# Altium schematic sheet Sheet2.SchDoc
size C; SheetNumber: 1; SheetTotal: 1
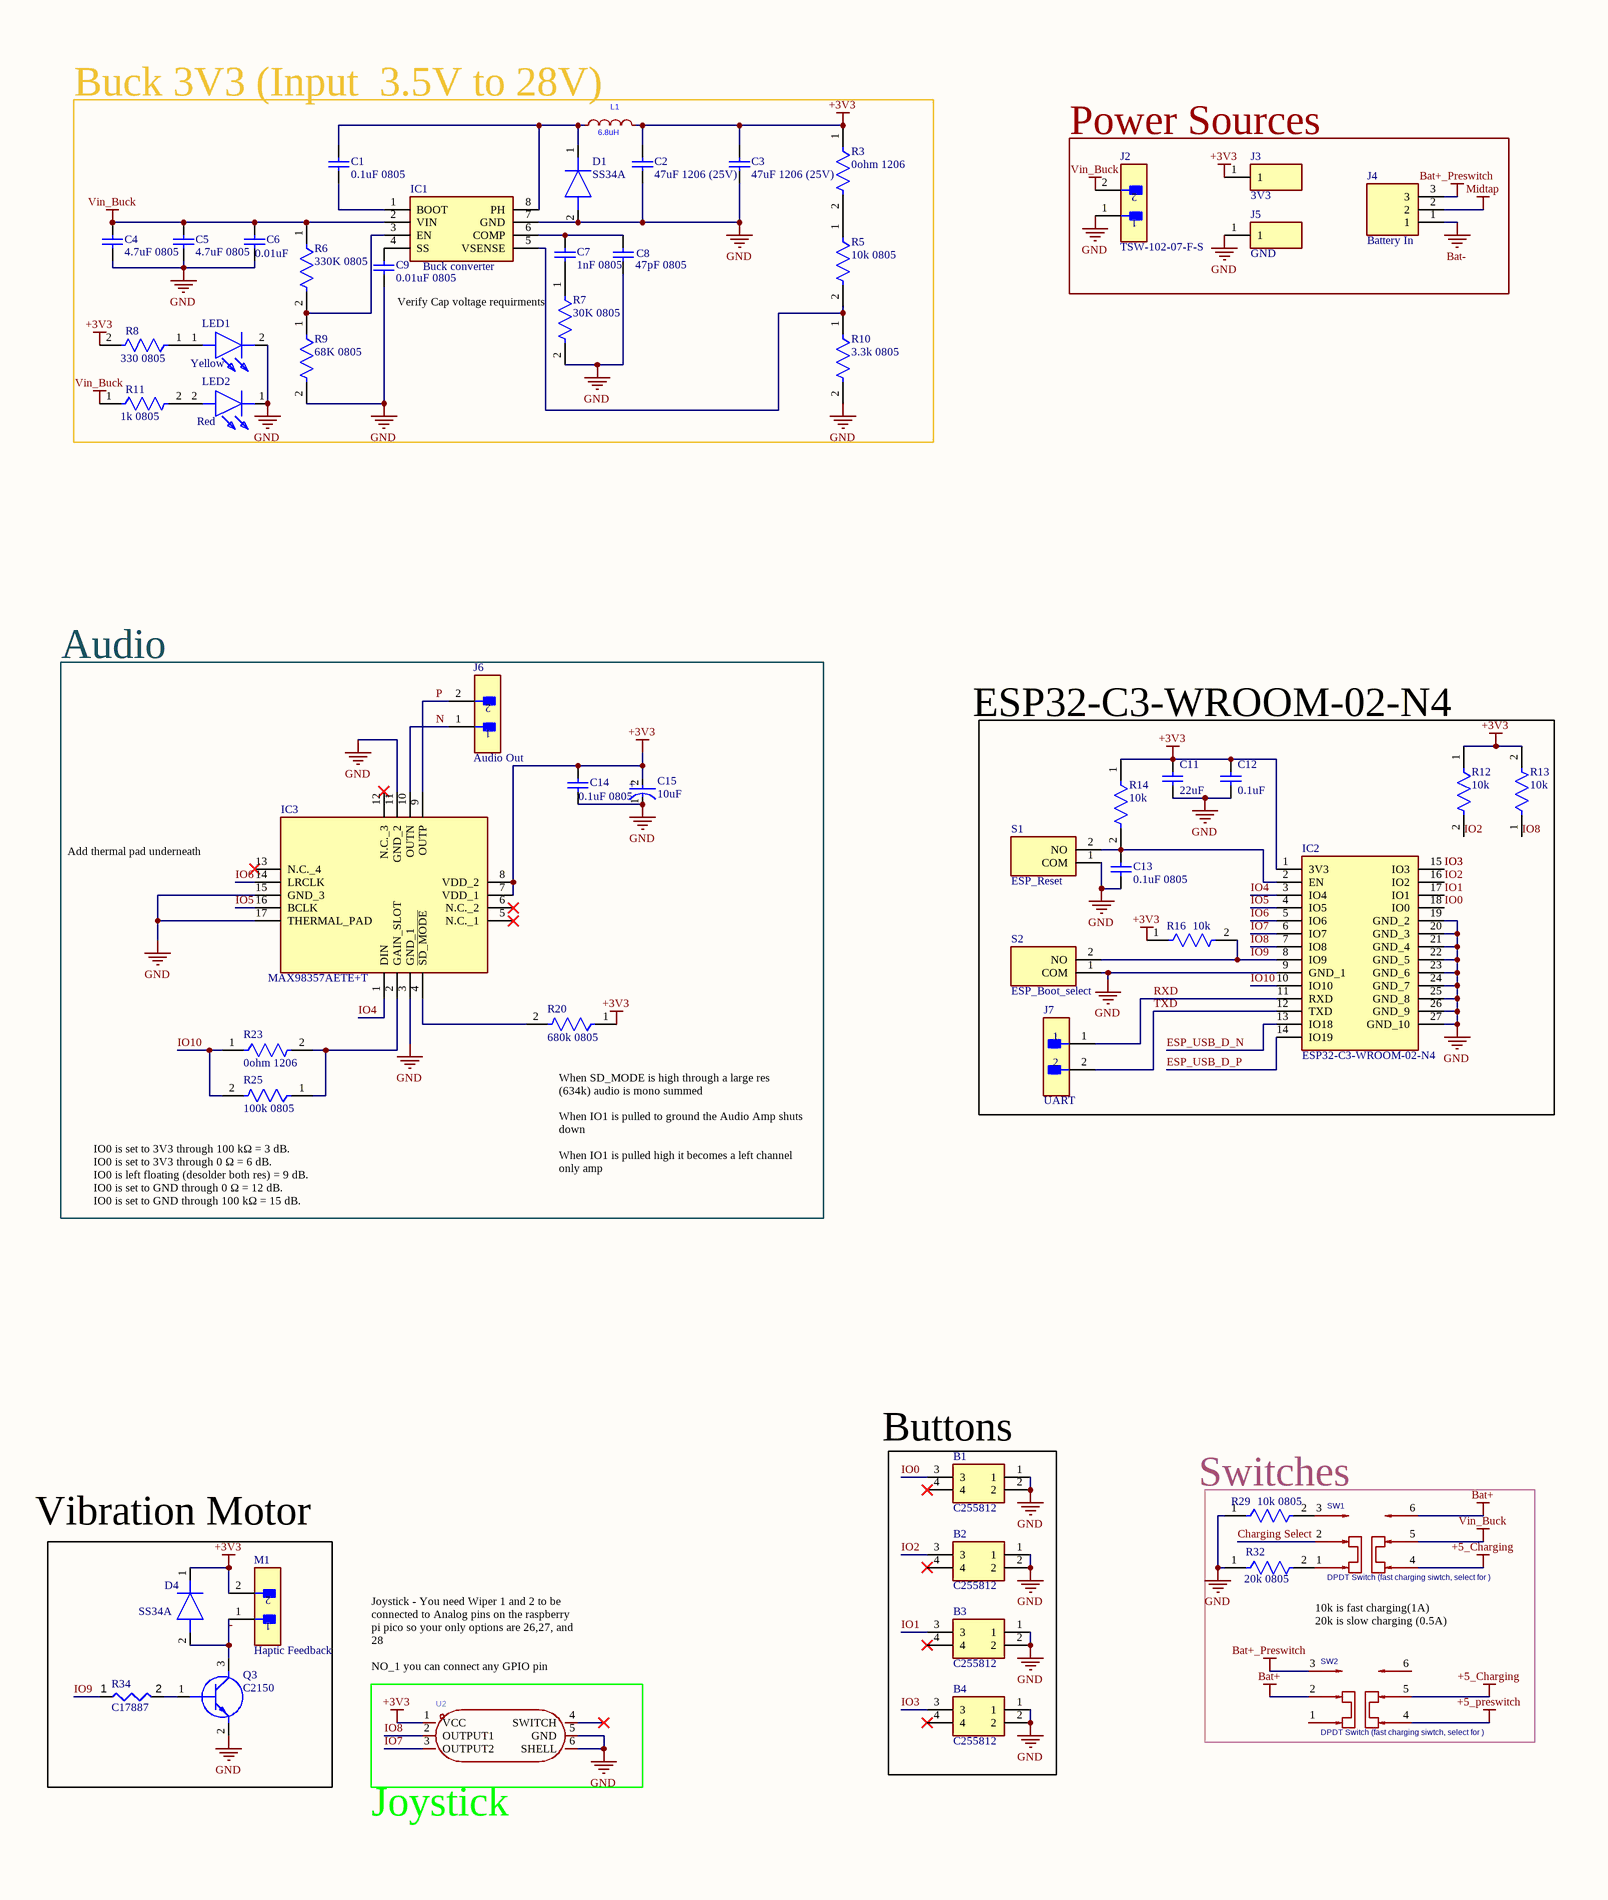
[diagram p0: Sheet2.SchDoc, left]
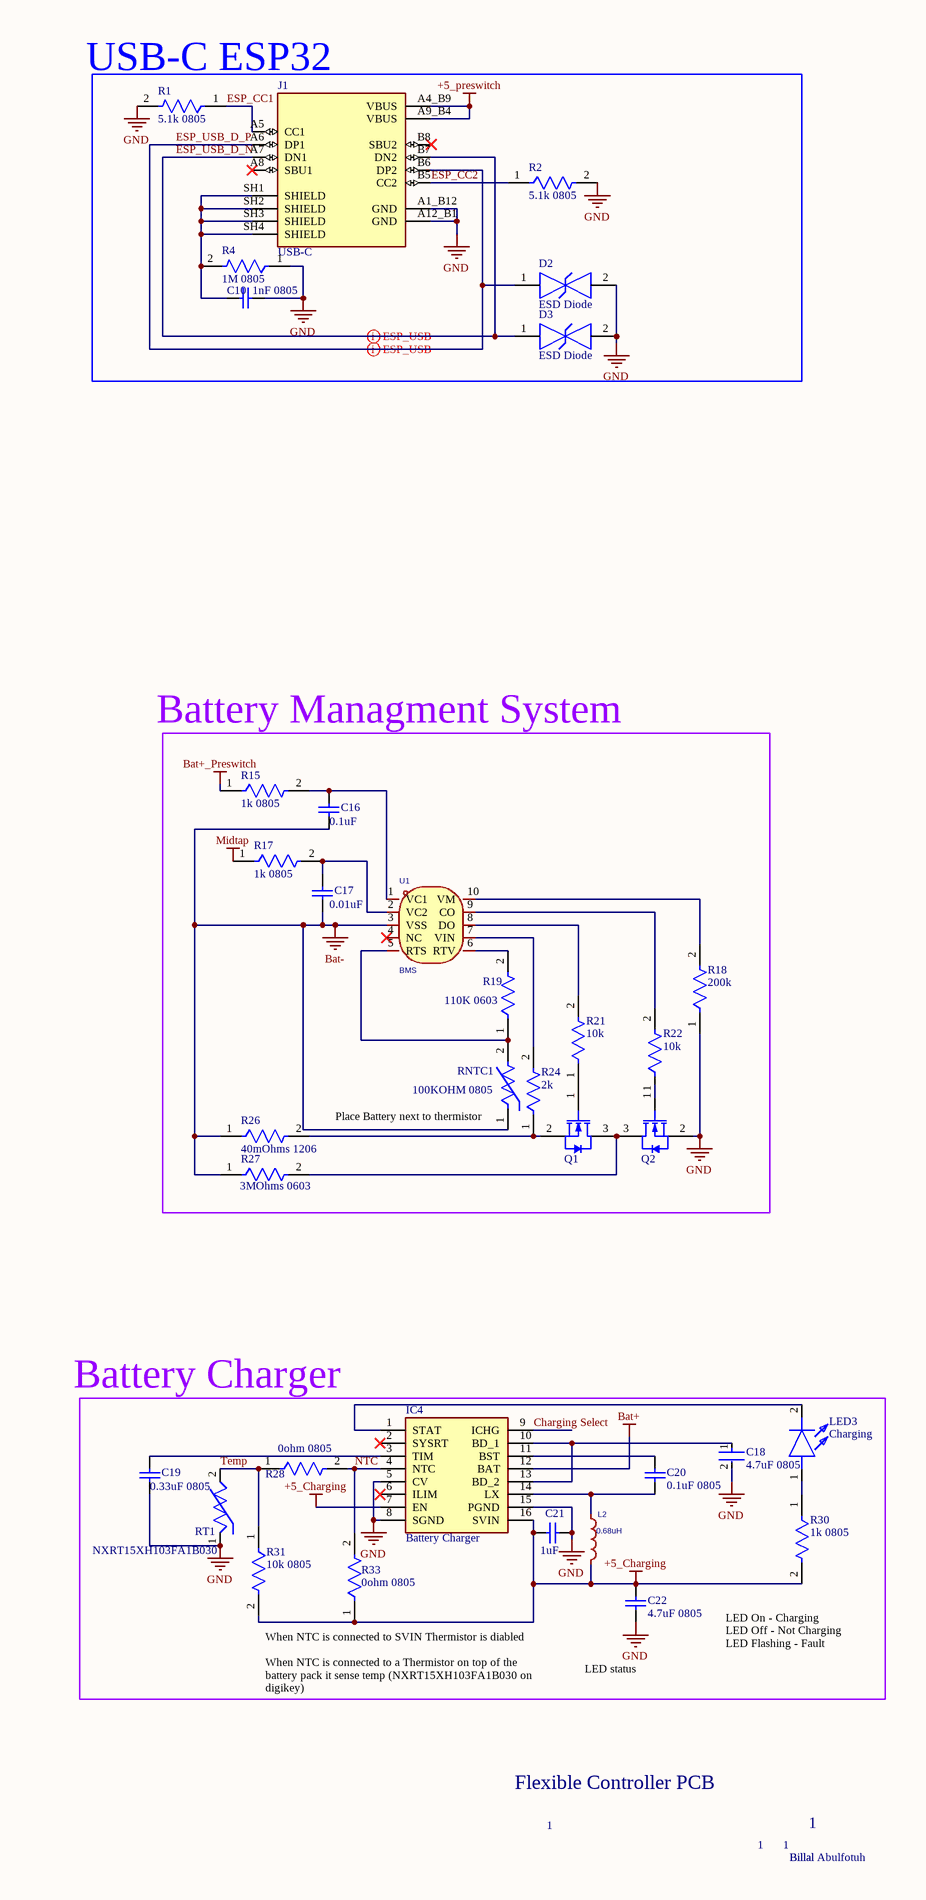
[diagram p1: Sheet2.SchDoc, right]

## Parts
B1  C255812  [Button]
B2  C255812  [Button]
B3  C255812  [Button]
B4  C255812  [Button]
C1  0.1uF 0805  [CAPC2013X94X50LL20T25]
C2  47uF 1206 (25V)  [CAPC1206(3216)190_N]
C3  47uF 1206 (25V)  [CAPC1206(3216)190_N]
C4  4.7uF 0805  [CAPC2013X94X50LL20T25]
C5  4.7uF 0805  [CAPC2013X94X50LL20T25]
C6  0.01uF  [CAPC2013X94X50LL20T25]
C7  1nF 0805  [CAPC2013X94X50LL20T25]
C8  47pF 0805  [CAPC2013X94X50LL20T25]
C9  0.01uF 0805  [CAPC2013X94X50LL20T25]
C10  1nF 0805  [CAPC2013X94X50LL20T25]
C11  22uF  [CAPC2013X94X50LL20T25]
C12  0.1uF  [CAPC2013X94X50LL20T25]
C13  0.1uF 0805  [CAPC2013X94X50LL20T25]
C14  0.1uF 0805  [CAPC2013X94X50LL20T25]
C15  10uF  [FP-TAJA-MFG]
C16  0.1uF  [CAPC2013X94X50LL20T25]
C17  0.01uF  [CAPC2013X94X50LL20T25]
C18  4.7uF 0805  [FP-CC0805-0_85-MFG]
C19  0.33uF 0805  [CAPC2013X94X50LL20T25]
C20  0.1uF 0805  [CAPC2013X94X50LL20T25]
C21  1uF  [CAPC2013X94X50LL20T25]
C22  4.7uF 0805  [CAPC2013X94X50LL20T25]
D1  SS34A  [DIOM5026X262N]
D2  ESD Diode  [FP-GG0402-MFG]
D3  ESD Diode  [FP-GG0402-MFG]
D4  SS34A  [DIOM5026X262N]
IC1  Buck converter  [SOIC127P600X175-8N]
IC2  ESP32-C3-WROOM-02-N4  [ESP32C3WROOM02N4]
IC3  MAX98357AETE+T  [QFN50P300X300X80-17N]
IC4  Battery Charger  [SY6982CQDC]
J1  USB-C  [KINGHELM_KH-TYPE-C-16P]
J2  TSW-102-07-F-S  [FP-TSW-102-07-F-S-MFG]
J3  3V3  [HDRV1W66P0X254_1X1_213X254X1074P]
J4  Battery In  [B3BXHALFSN]
J5  GND  [HDRV1W66P0X254_1X1_213X254X1074P]
J6  Audio Out  [FP-TSW-102-07-F-S-MFG]
J7  UART  [FP-TSW-102-07-F-S-MFG]
L1  6.8uH  [IND-SMD_L7.0-W6.6]
L2  0.68uH  [IND-SMD_L2.5-W2.0]
LED1  Yellow  [KT0805G]
LED2  Red  [LEDC1608X70N]
LED3  Charging  [KT0805G]
M1  Haptic Feedback  [FP-TSW-102-07-F-S-MFG]
Q1  Discharge Protection  [ONSC-SOT-23-3-318-08_V]  (value not drawn)
Q2  Charge Protection  [ONSC-SOT-23-3-318-08_V]  (value not drawn)
Q3  C2150  [SOT95P240X115-3N]
R1  5.1k 0805  [FP-RN73R2A-IPC_C]
R2  5.1k 0805  [FP-RN73R2A-IPC_C]
R3  0ohm 1206  [FP-HCJ1206-MFG]
R4  1M 0805  [FP-RN73R2A-IPC_C]
R5  10k 0805  [FP-RN73R2A-IPC_C]
R6  330K 0805  [FP-RN73R2A-IPC_C]
R7  30K 0805  [FP-RN73R2A-IPC_C]
R8  330 0805  [FP-RN73R2A-IPC_C]
R9  68K 0805  [FP-RN73R2A-IPC_C]
R10  3.3k 0805  [FP-RN73R2A-IPC_C]
R11  1k 0805  [FP-RN73R2A-IPC_C]
R12  10k  [FP-RN73R2A-IPC_C]
R13  10k  [FP-RN73R2A-IPC_C]
R14  10k  [FP-RN73R2A-IPC_C]
R15  1k 0805  [FP-RN73R2A-IPC_C]
R16  10k  [FP-RN73R2A-IPC_C]
R17  1k 0805  [FP-RN73R2A-IPC_C]
R18  200k  [FP-RN73R2A-IPC_C]
R19  110K 0603  [FP-RMCF0603-IPC_C]
R20  680k 0805  [FP-RN73R2A-IPC_C]
R21  10k  [FP-RN73R2A-IPC_C]
R22  10k  [FP-RN73R2A-IPC_C]
R23  0ohm 1206  [FP-HCJ1206-MFG]
R24  2k  [FP-RN73R2A-IPC_C]
R25  100k 0805  [FP-RN73R2A-IPC_C]
R26  40mOhms 1206  [FP-WSL1206-0_508-MFG]
R27  3MOhms 0603  [FP-AC0603-MFG]
R28  0ohm 0805  [FP-HCJ0805-MFG]
R29  10k 0805  [FP-RN73R2A-IPC_C]
R30  1k 0805  [FP-RN73R2A-IPC_C]
R31  10k 0805  [FP-RN73R2A-IPC_C]
R32  20k 0805  [FP-RN73R2A-IPC_C]
R33  0ohm 0805  [FP-HCJ0805-MFG]
R34  C17887  [Resistor 300Ohms]
RNTC1  100KOHM 0805  [FP-NCP21-0_2-IPC_A]
RT1  NXRT15XH103FA1B030  [THERM_NXRT15XH103FA1B030]
S1  ESP_Reset  [TS1088AR02016]
S2  ESP_Boot_select  [TS1088AR02016]
SW1  DPDT Switch (fast charging siwtch, select for )  [PCBComponent_1 - duplicate]
SW2  DPDT Switch (fast charging siwtch, select for )  [PCBComponent_1 - duplicate]
U1  BMS  [MSOP-10_L3.0-W3.0-P0.50-LS4.9-BL - duplicate]
U2  C42411044  [Correct Joystick]  (value not drawn)

## Blocks framed on the sheet
Buck 3V3 (Input  3.5V to 28V): C1-C9 D1 IC1 L1 LED1 LED2 R3 R5-R11
Power Sources: J2-J5
Audio: C14 C15 IC3 J6 R20 R23 R25

## Nets
+3V3: C2.2 C3.2 C11.1 C12.1 C14.1 C15.2(A) D4.1(K) IC2.1(3V3) IC3.7(VDD_1) IC3.8(VDD_2) J3.1 L1.2 M1.2 R3.1 R8.2 R12.1 R13.2 R14.1 R16.1 R20.1 U2.1(VCC)
+5_Charging: C21.1 C22.1 IC4.7(EN) IC4.16(SVIN) L2.2 R30.2 R31.2 R33.1 SW1.4 SW2.5
+5_preswitch: J1.A4_B9(VBUS) J1.A9_B4(VBUS) SW2.4
Bat+: IC4.12(BAT) SW1.6 SW2.2
Bat+_Preswitch: J4.3 R15.1 SW2.3
Bat-: C16.2 C17.2 J4.1 R26.1 R27.1 RNTC1.1 U1.3(VSS)
GND: B1.1 B1.2 B2.1 B2.2 B3.1 B3.2 B4.1 B4.2 C2.1 C3.1 C4.2 C5.2 C6.2 C8.2 C9.2 C10.1 C11.2 C12.2 C13.2 C14.2 C15.1(C) C18.2 C19.2 C21.2 C22.2 D1.2(A) D2.2(IO_2) D3.2(IO_2) IC1.7(GND) IC2.9(GND_1) IC2.19(GND_2) IC2.20(GND_3) IC2.21(GND_4) IC2.22(GND_5) IC2.23(GND_6) IC2.24(GND_7) IC2.25(GND_8) IC2.26(GND_9) IC2.27(GND_10) IC3.3(GND_1) IC3.11(GND_2) IC3.15(GND_3) IC3.17(THERMAL_PAD) IC4.5(CV) IC4.8(SGND) IC4.15(PGND) J1.A1_B12(GND) J1.A12_B1(GND) J2.1 J5.1 LED1.2(K) LED2.1(K) Q2.2(S) Q3.2(E) R1.2 R2.2 R4.1 R7.2 R9.2 R10.2 R18.1 R29.1 R32.1 RT1.1 S1.1(COM) S2.1(COM) U2.5(GND) U2.6(SHELL)
Midtap: J4.2 R17.1
Vin_Buck: C4.1 C5.1 C6.1 IC1.2(VIN) J2.2 R6.1 R11.1 SW1.5
-: D4.2(A) M1.1 Q3.3(C)
Charging Select: IC4.9(ICHG) SW1.2
ESP_CC1: J1.A5(CC1) R1.1
ESP_CC2: J1.B5(CC2) R2.1
ESP_USB_D_N: D3.1(IO_1) IC2.13(IO18) J1.A7(DN1) J1.B7(DN2)
ESP_USB_D_P: D2.1(IO_1) IC2.14(IO19) J1.A6(DP1) J1.B6(DP2)
IO0: B1.3 IC2.18(IO0)
IO1: B3.3 IC2.17(IO1)
IO2: B2.3 IC2.16(IO2) R12.2
IO3: B4.3 IC2.15(IO3)
IO4: IC2.3(IO4) IC3.1(DIN)
IO5: IC2.4(IO5) IC3.16(BCLK)
IO6: IC2.5(IO6) IC3.14(LRCLK)
IO7: IC2.6(IO7) U2.3(OUTPUT2)
IO8: IC2.7(IO8) R13.1 U2.2(OUTPUT1)
IO9: IC2.8(IO9) R16.2 R34.1 S2.2(NO)
IO10: IC2.10(IO10) R23.1 R25.2
N: IC3.10(OUTN) J6.1
NTC: IC4.4(NTC) R28.2 R33.2
P: IC3.9(OUTP) J6.2
RXD: IC2.11(RXD) J7.1
Temp: R28.1 R31.1 RT1.2
TXD: IC2.12(TXD) J7.2
NetC1_1: C1.1 D1.1(K) IC1.8(PH) L1.1
NetC1_2: C1.2 IC1.1(BOOT)
NetC7_1: C7.1 C8.1 IC1.6(COMP)
NetC7_2: C7.2 R7.1
NetC9_1: C9.1 IC1.4(SS)
NetC10_2: C10.2 J1.SH1(SHIELD) J1.SH2(SHIELD) J1.SH3(SHIELD) J1.SH4(SHIELD) R4.2
NetC13_1: C13.1 IC2.2(EN) R14.2 S1.2(NO)
NetC16_1: C16.1 R15.2 U1.1(VC1)
NetC17_1: C17.1 R17.2 U1.2(VC2)
NetC18_1: C18.1 IC4.10(BD_1) IC4.13(BD_2)
NetC19_1: C19.1 IC4.3(TIM)
NetC20_1: C20.1 IC4.11(BST)
NetC20_2: C20.2 IC4.14(LX) L2.1
NetIC1_3: IC1.3(EN) R6.2 R9.1
NetIC1_5: IC1.5(VSENSE) R5.2 R10.1
NetIC3_2: IC3.2(GAIN_SLOT) R23.2 R25.1
NetIC3_4: IC3.4(~{SD_MODE}) R20.2
NetIC4_1: IC4.1(STAT) LED3.2(K)
NetLED1_1: LED1.1(A) R8.1
NetLED2_2: LED2.2(A) R11.2
NetLED3_1: LED3.1(A) R30.1
NetQ1_1: Q1.1(G) R21.1
NetQ1_2: Q1.2(S) R24.1 R26.2
NetQ1_3: Q1.3(D) Q2.3(D) R27.2
NetQ2_1: Q2.1(G) R22.1
NetQ3_1: Q3.1(B) R34.2
NetR3_2: R3.2 R5.1
NetR18_2: R18.2 U1.10(VM)
NetR19_1: R19.1 RNTC1.2 U1.5(RTS)
NetR19_2: R19.2 U1.6(RTV)
NetR21_2: R21.2 U1.8(DO)
NetR22_2: R22.2 U1.9(CO)
NetR24_2: R24.2 U1.7(VIN)
NetR29_2: R29.2 SW1.3
NetR32_2: R32.2 SW1.1

Not connected (* = marked no-connect by the designer): B1 4*; B2 4*; B3 4*; B4 4*; IC3 5(N.C._1)* 6(N.C._2)* 12(N.C._3)* 13(N.C._4)*; IC4 2(SYSRT)* 6(ILIM)*; J1 A8(SBU1)* B8(SBU2)*; SW2 1 6; U1 4(NC)*; U2 4(SWITCH)*

## Layout directives
differential pair; differential pair class USB: ESP_USB_D_N, ESP_USB_D_P

## Notes on the sheet
- USB-C ESP32
- (near R7) Verify Cap voltage requirments
- ESP32-C3-WROOM-02-N4
- Battery Managment System
- Add thermal pad underneath
- (near RNTC1) Place Battery next to thermistor
- (near R20) When SD_MODE is high through a large res (634k) audio is mono summed
  When IO1 is pulled to ground the Audio Amp shuts down
  When IO1 is pulled high it becomes a left channel only amp
- (near R25) IO0 is set to 3V3 through 100 kΩ = 3 dB.
  IO0 is set to 3V3 through 0 Ω = 6 dB.
  IO0 is left floating (desolder both res) = 9 dB.
  IO0 is set to GND through 0 Ω = 12 dB.
  IO0 is set to GND through 100 kΩ = 15 dB.
- (near IC4) Battery Charger
- (near B1) Buttons
- Vibration Motor
- Switches
- 10k is fast charging(1A)
  20k is slow charging (0.5A)
- LED On - Charging
  LED Off - Not Charging
  LED Flashing - Fault
- (near U2) Joystick - You need Wiper 1 and 2 to be connected to Analog pins on the raspberry pi pico so your only options are 26,27, and 28
  NO_1 you can connect any GPIO pin
- When NTC is connected to SVIN Thermistor is diabled
  When NTC is connected to a Thermistor on top of the battery pack it sense temp (NXRT15XH103FA1B030 on digikey)
- LED status
- Flexible Controller PCB
- (near U2) Joystick
- 1
- Billal Abulfotuh
- Billal
- (in symbol CMP-1661-00004-2) +

## Library data of the parts
B1-B4 = 1TS005F-2500-5001: Switch; Manufacturer_Name: HYP (Hongyuan Precision); Datasheet Link: https://datasheet.lcsc.com/szlcsc/HYP-1TS005F-2500-5001_C255812.pdf; Height: 5.1mm; Manufacturer_Part_Number: 1TS005F-2500-5001
C1 C12-C14 C16 C20 = CMP-2007-04160-1: C28233; Part Number: 08051C102KAT4A; Manufacturer: AVX Interconnect / Elco
C2 C3 = CMP-1037-05002-1: C6119973; Case-Metric: 3216; Case-EIA: 1206; Tolerance: Â±20%; Rated Voltage: 10 V; Technology: SMT; Value: 47uF; Max Thickness: 1.9 mm
C4 C5 C22 = CMP-2007-04160-1: C1779; Part Number: 08051C102KAT4A; Manufacturer: AVX Interconnect / Elco
C6 C9 C17 = CMP-2007-04160-1: C1710; Part Number: 08051C102KAT4A; Manufacturer: AVX Interconnect / Elco
C7 C10 = CMP-2007-04160-1: C46653; Part Number: 08051C102KAT4A; Manufacturer: AVX Interconnect / Elco
C8 = CMP-2007-04160-1: C14857; Part Number: 08051C102KAT4A; Manufacturer: AVX Interconnect / Elco
C11 = CMP-2007-04160-1: C45783; Part Number: 08051C102KAT4A; Manufacturer: AVX Interconnect / Elco
C15 = CMP-1661-00004-2: C7171; Voltage Rating: 16V; ESR (Equivalent Series Resistance): 3R; Leakage Current: 1.6uA; Dissipation Factor: 8%; Dielectric Material: Tantalum; Polarity: Polar; Tolerance: 10%; Length: 3.2mm; Features: General Purpose; Voltage: 16V; Mount: Surface Mount; Case/Package: 1206; Number of Pins: 2; Case Code (Metric): 3216; Radiation Hardening: No; Min Operating Temperature: -55°C; Case Code (Imperial): 1206; Height - Seated (Max): 0.071inch; Lead Free: Lead Free; Termination: SMD/SMT; Width: 1.6mm; Capacitance: 10uF; Lead Pitch: 1.1mm; Max Operating Temperature: 125°C; Voltage Rating (DC): 16V; Packaging: Tape and Reel; Package Quantity: 1; REACH SVHC: No SVHC; Depth: 1.6mm; Height: 1.6mm; LCSC: C7171
C18 = CMP-03422-000966-1: C1779; Manufacturer: Yageo; Manufacturer Part Number: CC0805KKX5R9BB475; Tolerance: 0.1; Voltage Rating: 50 V; Material: Ceramic; Temperature Characteristic: X5R; Capacitance: 4.7 uF; Value: 4.7 uF; Height: 0.95mm; Category: Cap; ComponentLink2Description: Datasheet; Lead Free: Yes; Device Class L2: Capacitors; Temperature Range High: +85°C; ComponentLink2URL: http://www.yageo.com/documents/recent/UPY-GPHC_Y5V_6.3V-to-50V_8.pdf; Ipc Land Pattern Name: CAPC200125X85; Octopart: https://octopart.com/cc0805kkx5r9bb475-yageo-81932641; Temperature Range Low: -30°C; Digikey Description: CAP CER 4.7UF 50V X5R 0805; Package: CC0805-0.85; Device Class L1: Passive Components; RoHS: TRUE; Device Class L3: Ceramic Capacitors; Automotive: No; Temperature: -30°C to +85°C; Footprint Url: http://www.yageo.com/exep/pages/download/literatures/UPY-C_GEN_24.pdf
C19 = CMP-2007-04160-1: C1740; Part Number: 08051C102KAT4A; Manufacturer: AVX Interconnect / Elco
C21 = CMP-2007-04160-1: C28323; Part Number: 08051C102KAT4A; Manufacturer: AVX Interconnect / Elco
D1 = SS34A: C8678; Manufacturer_Name: HY Electronic; Datasheet Link: https://datasheet.datasheetarchive.com/originals/distributors/Datasheets-3/DSA-43252.pdf; Height: 2.62mm; Manufacturer_Part_Number: SS34A
D2 D3 = CMP-04587-000001-1: C10662; Manufacturer Part Number: GG040205100N2P; Manufacturer: AVX Corporation; Reverse Standoff Voltage: 5V; Number Of Channels: 1; Clamping Voltage: 12V; Peak Pulse Current: 16A; Capacitance: 10pF; Direction: Bidirectional; Value: 10pF; Breakdown Voltage: 5.5V; Peak Pulse Power: 96W; Automotive: No; ComponentLink2URL: http://datasheets.avx.com/AVX-GiGuard.pdf; Lead Free: Yes; Device Class L2: TVS Diodes; Temperature: -55°C to +125°C; Category: Diode; Octopart: https://octopart.com/gg040205100n2p-avx-81066081; Ipc Land Pattern Name: DIOC10060X50; Digikey Description: TVS DIODE 5V 12V 0402; Device Class L3: unset; ComponentLink2Description: Datasheet; Temperature Range Low: -55°C; Temperature Range High: +125°C; Device Class L1: Circuit Protection; Height: 0.55mm; Package: GG0402; RoHS: TRUE
D4 = SS34A: Diode; Manufacturer_Name: HY Electronic; Datasheet Link: https://datasheet.datasheetarchive.com/originals/distributors/Datasheets-3/DSA-43252.pdf; Height: 2.62mm; Manufacturer_Part_Number: SS34A
IC1 = TPS54331D: C9865; Manufacturer_Name: Texas Instruments; Datasheet Link: http://www.ti.com/lit/gpn/tps54331; Height: 1.75mm; Manufacturer_Part_Number: TPS54331D; Mouser Part Number: 595-TPS54331D; Mouser Price/Stock: https://www.mouser.co.uk/ProductDetail/Texas-Instruments/TPS54331D?qs=QyYHynRG50pEbpiybdzwkw%3D%3D; Arrow Part Number: TPS54331D; Arrow Price/Stock: https://www.arrow.com/en/products/tps54331d/texas-instruments?utm_currency=USD&region=europe
IC2 = ESP32-C3-WROOM-02-N4: C2934560; Manufacturer_Name: Espressif Systems; Datasheet Link: https://www.mouser.ch/datasheet/2/891/Espressif_ESP32_C3_WROOM_02-2006871.pdf; Height: 3.35mm; Manufacturer_Part_Number: ESP32-C3-WROOM-02-N4; Mouser Part Number: 356-ESP32C3WROOM02N4; Mouser Price/Stock: https://www.mouser.co.uk/ProductDetail/Espressif-Systems/ESP32-C3-WROOM-02-N4?qs=stqOd1AaK7%2FqjTZKEOgfUg%3D%3D
IC3 = MAX98357AETE+T: C910544; Manufacturer_Name: Analog Devices; Datasheet Link: https://datasheets.maximintegrated.com/en/ds/MAX98357A-MAX98357B.pdf; Height: 0.8mm; Manufacturer_Part_Number: MAX98357AETE+T; Mouser Part Number: 700-MAX98357AETE+T; Mouser Price/Stock: https://www.mouser.co.uk/ProductDetail/Analog-Devices-Maxim-Integrated/MAX98357AETE%2bT?qs=AAveGqk956HhNpoJjF5x2g%3D%3D; Arrow Part Number: MAX98357AETE+T; Arrow Price/Stock: https://www.arrow.com/en/products/max98357aetet/analog-devices?utm_currency=USD&region=nac
IC4 = SY6982CQDC: C7435940; Manufacturer_Name: Silergy; Datasheet Link: https://arvidtek.com/wp-content/uploads/2025/01/2307111037_Silergy-Corp-SY6982CQDC_C7435940.pdf; Height: 0.9mm; Manufacturer_Part_Number: SY6982CQDC
J1 = KH-TYPE-C-16P: C2765186; MF: kinghelm; SnapEDA_Link: https://www.snapeda.com/parts/KH-TYPE-C-16P/Kinghelm/view-part/?ref=snap; Package: None; Value: *; MP: KH-TYPE-C-16P; Check_prices: https://www.snapeda.com/parts/KH-TYPE-C-16P/Kinghelm/view-part/?ref=eda
J2 J6 J7 M1 = CMP-02766-001458-1: CONN HEADER VERT 2POS 2.54MM; Gender: Male; Max Current Rating: 7.6A; Number of Contacts: 2; Max Voltage Rating (AC): 550V; Orientation: Straight; Depth: 2.54mm; Series: TSW; Package Quantity: 1; Min Operating Temperature: -55°C; Max Operating Temperature: 125°C; Contact Type: Male Pin; Contact Shape: Square; Color: Black; Housing Color: Black; Connector Type: Header; Fastening Type: Pull; Radiation Hardening: No; Pitch: 2.54mm; Housing Material: Polyester; Mount: Through Hole; Number of Positions: 2; Number of Rows: 1; Contact Material: Bronze; Insulation Color: Black; Contact Finish - Mating: GOLD; Termination: Solder; Insulation Material: PBT; Length: 5.08mm; Flammability Rating: UL94 V-0; Contact Mating Length: 0.23inch; REACH SVHC: No SVHC; Contact Plating: Gold; RoHS Compliant: Yes; Packaging: Bulk
J3 J5 = 87224-1: Connector; Manufacturer_Name: TE Connectivity; Datasheet Link: https://www.te.com/commerce/DocumentDelivery/DDEController?Action=srchrtrv&DocNm=87224&DocType=Customer+Drawing&DocLang=English; Height: 10.744mm; Manufacturer_Part_Number: 87224-1; Mouser Part Number: 571-872241; Mouser Price/Stock: https://www.mouser.co.uk/ProductDetail/TE-Connectivity/87224-1?qs=uJX40y%252BSWqgHHhtbHlovpg%3D%3D; Arrow Part Number: 87224-1; Arrow Price/Stock: https://www.arrow.com/en/products/87224-1/te-connectivity?region=nac
J4 = B3B-XH-A_LF__SN_: C144394; Manufacturer_Name: JST (JAPAN SOLDERLESS TERMINALS); Manufacturer_Part_Number: B3B-XH-A(LF)(SN); Datasheet Link: https://datasheet.lcsc.com/szlcsc/1812131720_JST-Sales-America-B3B-XH-A-LF-SN_C144394.pdf; Height: 7mm; Mouser Part Number: 306-B3BXHALFSNP; Mouser Price/Stock: https://www.mouser.co.uk/ProductDetail/JST-Commercial/B3B-XH-ALFSN?qs=cdbOS8ANM9BVkoboCCIEMQ%3D%3D; Arrow Part Number: B3B-XH-A(LF)(SN); Arrow Price/Stock: https://www.arrow.com/en/products/b3b-xh-a-lf-sn/jst-manufacturing?utm_currency=USD&region=europe
L1 = FXL0630-6R8-M: C167221; Manufacturer: cjiang(长江微电); Add into BOM: yes; Tolerance: ±20%; Current Rating: 5A; Current - Saturation(Isat): 6A; DC Resistance(DCR): 48mΩ; Type: Molded Inductor; Symbol: FXL0630-6R8-M; Device: FXL0630-6R8-M; LCSC Part Name: 6.8uH ±20% 6A; Supplier Part: C167221; Manufacturer Part: FXL0630-6R8-M; Supplier Footprint: SMD,7x6.6mm; JLCPCB Part Class: Extended Part; Datasheet: https://item.szlcsc.com/datasheet/FXL0630-6R8-M/178604.html; Supplier: LCSC; Convert to PCB: yes; Value: 6.8uH
L2 = 252012CDMCDDS-R68MC: C492726; Manufacturer: Sumida(胜美达); Add into BOM: yes; Value: 680nH; Tolerance: ±20%; Current - Saturation(Isat): 6.3A; DC Resistance(DCR): 30mΩ; Type: Molded Inductor; Symbol: 252012CDMCDDS-R68MC; Device: 252012CDMCDDS-R68MC; LCSC Part Name: 680nH ±20% 6.3A; Supplier Part: C492726; Manufacturer Part: 252012CDMCDDS-R68MC; Supplier Footprint: 1008; JLCPCB Part Class: Extended Part; Datasheet: https://item.szlcsc.com/datasheet/252012CDMCDDS-R68MC/503355.html; Supplier: LCSC; Convert to PCB: yes; Current Rating: -; Ratings: -
LED1 = KT-0805G: C2296; Manufacturer_Name: Hubei KENTO Elec; Datasheet Link: https://jlcpcb.com/api/file/downloadByFileSystemAccessId/8639582106239348736; Height: 0.95mm; Manufacturer_Part_Number: KT-0805G
LED2 = KT-0603R: C2286; Manufacturer_Name: Hubei KENTO Elec; Datasheet Link: https://datasheet.lcsc.com/szlcsc/Hubei-KENTO-Elec-KT-0603R_C2286.pdf; Height: 0.7mm; Manufacturer_Part_Number: KT-0603R; LCSC: C2286
LED3 = KT-0805G: C2297; Manufacturer_Name: Hubei KENTO Elec; Datasheet Link: https://jlcpcb.com/api/file/downloadByFileSystemAccessId/8639582106239348736; Height: 0.95mm; Manufacturer_Part_Number: KT-0805G
Q1 Q2 = CMP-1058-00781-1: C20917; Manufacturer: On Semiconductor; PartNumber: 2N7002LT1G; Channel Polarity: N Channel; V(BR)DSS Min (V): 60; ID Max (A): 0.115; VGS Max (V): 20; Configuration: Single; VGS(th) Max (V): 2.5; Packing: Tape and Reel; ComponentLink1URL: http://www.onsemi.com/; ComponentLink3Description: Package Specification; ComponentLink3URL: http://www.onsemi.cn/pub_link/Collateral/318-08.PDF; PackageReference: SOT-23-3-318-08; RoHS: Pb-Free; ComponentLink2URL: http://www.onsemi.com/pub_link/Collateral/2N7002L-D.PDF; ComponentLink1Description: Manufacturer URL; Package Type: SOT-23-3; DatasheetVersion: Rev. 7; Mounting Technology: Surface Mount; ComponentLink2Description: Datasheet; PackageDescription: 3-Pin Small Outline Transistor, Body 2.92 x 1.3 mm, Pitch 0.95 mm; PackageVersion: Rev. AP, 11/2009
Q3 = SS8050-G: Manufacturer_Name: Comchip Technology; Datasheet Link: https://datasheet.datasheetarchive.com/originals/distributors/DKDS-12/229454.pdf; Height: 1.15mm; Manufacturer_Part_Number: SS8050-G; Mouser Part Number: 750-SS8050-G; Mouser Price/Stock: https://www.mouser.co.uk/ProductDetail/Comchip-Technology/SS8050-G?qs=LLUE9lz1YbcHg%252BWLMAtcrQ%3D%3D; Arrow Part Number: SS8050-G; Arrow Price/Stock: https://www.arrow.com/en/products/ss8050-g/comchip-technology?region=nac
R1 R2 = CMP-04015-014497-1: C27834
R3 R23 = CMP-26527-002752-1: C17888; Resistance: 0mR; Radiation Hardening: No; Features: Automotive AEC-Q200; RoHS Compliant: Yes; Height: 0.026inch; Case Code (Metric): 3216; Min Operating Temperature: -55°C; Number of Terminations: 2; Mount: Surface Mount; Case/Package: 1206; Termination: Wraparound; Length: 0.122inch; Packaging: Tape and Reel; Max Operating Temperature: 155°C; Case Code (Imperial): 1206; Package Quantity: 5000; Width: 0.061inch
R4 = CMP-04015-014497-1: C17514
R5 R12-R14 R16 R21 R22 R29 R31 = CMP-04015-014497-1: C17414
R6 = CMP-04015-014497-1: C17629
R7 = CMP-04015-014497-1: C17621
R8 = CMP-04015-014497-1: C17630
R9 = CMP-04015-014497-1: C17801
R10 = CMP-04015-014497-1: C26010
R11 R15 R17 R30 = CMP-04015-014497-1: C1015
R18 = CMP-04015-014497-1: C17539
R19 = CMP-26527-002287-1: C25805; Max Power Dissipation: 100mW; Temperature Coefficient: 200ppm/°C; Tolerance: 5%; Resistance: 110kR; Size Code: 0603; Lead Free: Lead Free; Case/Package: 0603; Radiation Hardening: No; Number of Terminations: 2; Max Operating Temperature: 155°C; Length: 0.061inch; RoHS Compliant: Yes; Resistor Type: Thick Film; Mount: Surface Mount; Power Rating: 100mW; Width: 0.031inch; Min Operating Temperature: -55°C; Packaging: Tape and Reel; Case Code (Imperial): 0603; Series: RMCF; Features: Automotive AEC-Q200; Contact Plating: Tin; Height: 0.022inch; Case Code (Metric): 1608
R20 = CMP-04015-014497-1: C17797
R24 = CMP-04015-014497-1: C17604
R25 = CMP-04015-014497-1: C149504
R26 = CMP-2003-04359-2: C49654479; NexarPartId: 39745044; Power Rating: 250mW; Temperature Coefficient: 75ppm/°C; Tolerance: 1%; Resistance: 40mΩ; Max Power Dissipation: 500mW; Number of Pins: 1206; REACH SVHC: Unknown; Radiation Hardening: No; Width: 1.6002mm; Schedule B: 8533210045, 8533210045; Contact Plating: Tin; Number of Terminations: 2; Features: Moisture Resistant; Case Code (Imperial): 1206; Military Standard: Not; Lead Free: Lead Free; Case Code (Metric): 3216; Composition: Metal Element; Max Operating Temperature: 170°C; Termination: SMD/SMT; Min Operating Temperature: -65°C; Case/Package: 1206; Packaging: Cut Tape; Height: 635µm; RoHS: Compliant; Depth: 1.6mm; Length: 3.2mm; Mount: Surface Mount
R27 = CMP-03412-043951-1: RES 3MΩ 1.00% 0.1W 0603; Power Rating: 100mW; Voltage Rating: 50V; Resistance: 3MR; Temperature Coefficient: 100ppm/°C; Tolerance: 1%; Number of Terminations: 2; Case Code (Metric): 1608; Resistor Type: Thick Film; Termination: SMD/SMT; Case/Package: 0603; RoHS Compliant: Yes; Features: Moisture Resistant; Max Power Dissipation: 100mW; Case Code (Imperial): 0603; Max Operating Temperature: 155°C; Width: 0.8mm; Packaging: Tape and Reel; Length: 0.063inch; Min Operating Temperature: -55°C; Series: AC; Height: 0.022inch
R28 R33 = CMP-26527-000104-1: C17477; Resistance: 0mR; Radiation Hardening: No; Case Code (Imperial): 0805; Number of Terminations: 2; Lead Free: Lead Free; Max Operating Temperature: 155°C; Width: 0.049inch; Case Code (Metric): 2012; Height: 0.026inch; Mount: Surface Mount; Min Operating Temperature: -55°C; Packaging: Tape and Reel; Package Quantity: 1; Termination: Wraparound; Length: 0.079inch; RoHS Compliant: Yes; Case/Package: 0805
R32 = CMP-04015-014497-1: C4328
R34 = Resistor 300Ohms
RNTC1 = CMP-06022-000440-1: C338605; Accuracy: 3%; Max Power Dissipation: 200mW; Resistance: 100kR; Current Rating: 100uA; Tolerance: 5%; Package Quantity: 4000; Lead Free: Lead Free; REACH SVHC: No SVHC; Radiation Hardening: No; Case Code (Metric): 2012; Width: 1.25mm; Length: 2mm; Depth: 1.25mm; Min Operating Temperature: -40°C; Number of Pins: 2; Power Rating: 200mW; Height: 0.85mm; Max Operating Temperature: 125°C; Case Code (Imperial): 0805; Case/Package: 0805; Termination: SMD/SMT; Mount: Surface Mount; Packaging: Tape and Reel
RT1 = NXRT15XH103FA1B030: THERMISTOR NTC 10KOHM 3380K BEAD; MF: Murata; Package: RADIAL-2 Murata; Price: None; Value: *; SnapEDA_Link: https://www.snapeda.com/parts/NXRT15XH103FA1B030/Murata/view-part/4970536/?ref=snap; MP: NXRT15XH103FA1B030; Availability: Good; Purchase-URL: https://pricing.snapeda.com/search/part/NXRT15XH103FA1B030/?ref=eda; Check_prices: https://www.snapeda.com/parts/NXRT15XH103FA1B030/Murata/view-part/4970536/?ref=eda
S1 S2 = TS-1088-AR02016: C720477; Manufacturer_Name: XUNPU; Datasheet Link: https://www.xunpudianzi.com/uploads/pdf/TS-1088-ARXXX.pdf; Height: 2mm; Manufacturer_Part_Number: TS-1088-AR02016
SW1 SW2 = SS-22F32-G060: C2848931; Manufacturer: G-Switch(品赞); Add into BOM: yes; Actuator Style: Rectangular Columnar; Switch Height: 13mm; Actuator Color: Black; Current Rating: 1A; Voltage Rating: 24V; Life: 10,000 Cycles; Symbol: SS-22F32-G060; Device: SS-22F32-G060; LCSC Part Name: 柄长6mm 直插两档 滑动开关; Supplier Part: C2848931; Manufacturer Part: SS-22F32-G060; Supplier Footprint: 插件,23.2x7.5mm; JLCPCB Part Class: Extended Part; Datasheet: https://item.szlcsc.com/datasheet/SS-22F32-G060/3048280.html; Supplier: LCSC; Convert to PCB: yes; Circuit: DPDT; Termination Style: PC Pin; Length: 23.2mm; Width: 7.5mm; Mounting Type: Through Hole; Operating Temperature: -25℃~+70℃
U1 = CM1022-CA: C22446437; Manufacturer: iCM(创芯微); Add into BOM: yes; The Chip Type: Protection IC; Charging Saturation Voltage: 4.25V; End-Off Voltage: 2.5V; Type of Battery: Lithium-ion/Polymer; Number of Cells: 2; Battery Temperature Detection: Support; Supply Current (Iq): 5uA; Symbol: CM1022-CA; Device: CM1022-CA; LCSC Part Name: 2节,带温度保护; Supplier Part: C22446437; Manufacturer Part: CM1022-CA; Supplier Footprint: MSOP-10; JLCPCB Part Class: Extended Part; Datasheet: https://item.szlcsc.com/datasheet/CM1022-CA/24098222.html; Supplier: LCSC; Convert to PCB: yes; Operating Temperature: -40℃~+85℃
U2 = YHE-YG16-001 SH1B166A1: Manufacturer: YTL(亚特联); Add into BOM: yes; Symbol: YHE-YG16-001 SH1B166A1; Device: YHE-YG16-001 SH1B166A1; LCSC Part Name: YHE-YG16-001 SH1B166A1; Supplier Part: C42411044; Manufacturer Part: YHE-YG16-001 SH1B166A1; Supplier Footprint: 插件; Datasheet: https://atta.szlcsc.com/upload/public/pdf/source/20241210/EC2F2FFC22DA7A673EF560687C693A55.pdf; Supplier: LCSC; Convert to PCB: yes